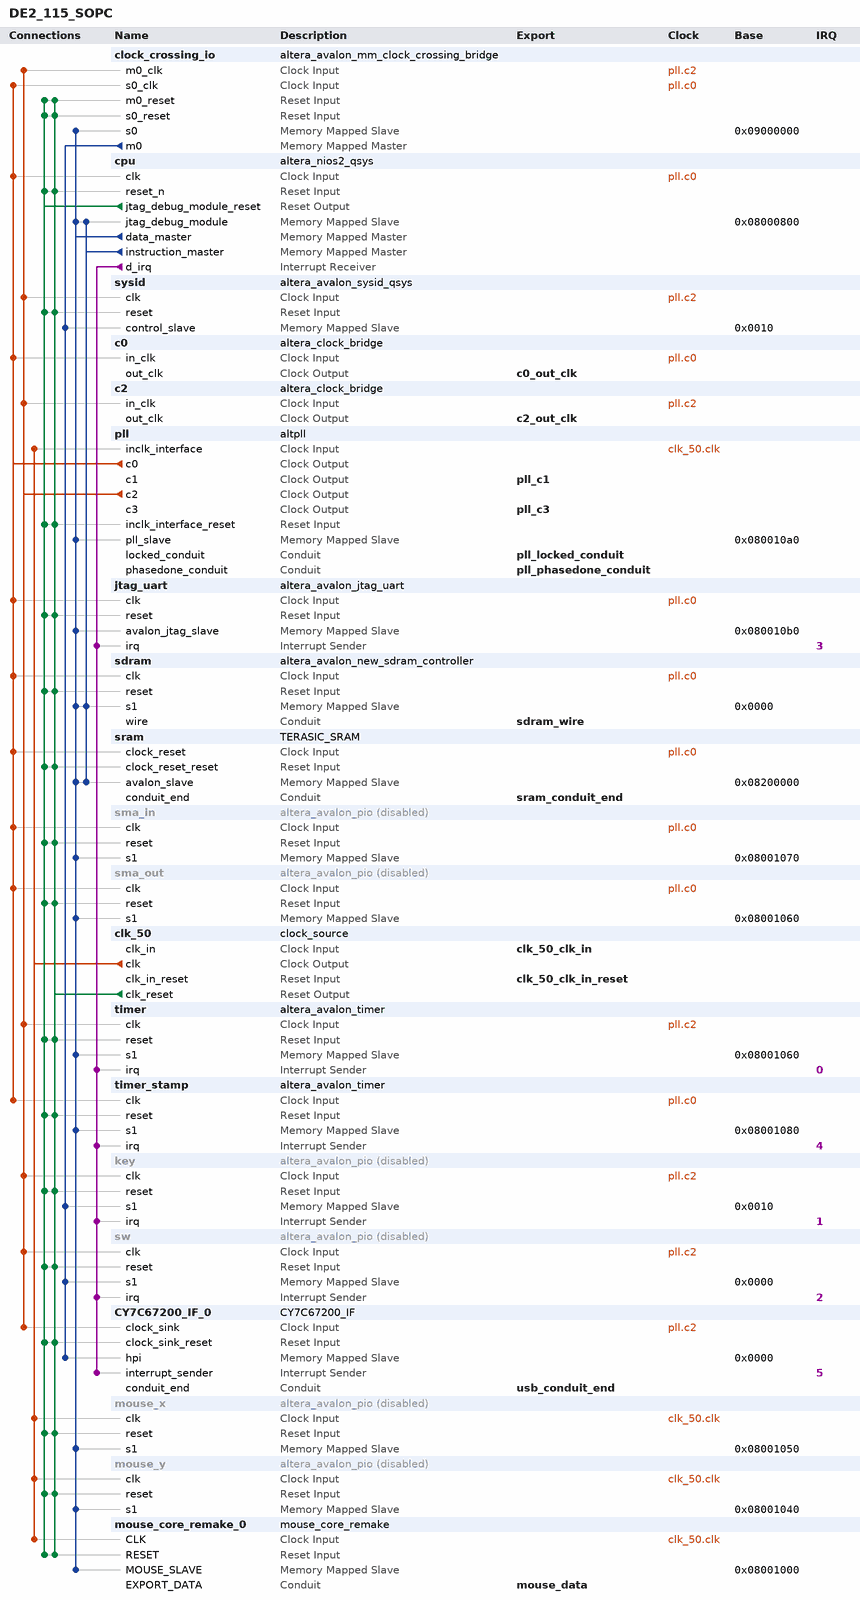
[diagram p0: system contents]
# Platform Designer (Qsys) system DE2_115_SOPC, Cyclone IV E EP4CE115F29C7
# Parameters at their usual value, and those the tool derives, are not listed.
package require -exact qsys 15.0
create_system DE2_115_SOPC
set_project_property DEVICE_FAMILY {Cyclone IV E}
set_project_property DEVICE EP4CE115F29C7

add_instance clock_crossing_io altera_avalon_mm_clock_crossing_bridge 15.0
set_instance_parameter_value clock_crossing_io ADDRESS_WIDTH 22
set_instance_parameter_value clock_crossing_io COMMAND_FIFO_DEPTH 32
set_instance_parameter_value clock_crossing_io DATA_WIDTH 32
set_instance_parameter_value clock_crossing_io MASTER_SYNC_DEPTH 3
set_instance_parameter_value clock_crossing_io MAX_BURST_SIZE 1
set_instance_parameter_value clock_crossing_io RESPONSE_FIFO_DEPTH 256
set_instance_parameter_value clock_crossing_io SLAVE_SYNC_DEPTH 3
set_instance_parameter_value clock_crossing_io USE_AUTO_ADDRESS_WIDTH 0

add_instance cpu altera_nios2_qsys 15.0
set_instance_parameter_value cpu breakSlave cpu.jtag_debug_module
set_instance_parameter_value cpu exceptionSlave sdram.s1
set_instance_parameter_value cpu icache_size 4096
set_instance_parameter_value cpu impl Fast
set_instance_parameter_value cpu manuallyAssignCpuID false
set_instance_parameter_value cpu resetSlave sdram.s1
set_instance_parameter_value cpu resetrequest_enabled true

add_instance sysid altera_avalon_sysid_qsys 15.0
set_instance_parameter_value sysid id 0

add_instance c0 altera_clock_bridge 15.0
set_instance_parameter_value c0 DERIVED_CLOCK_RATE 100000000
set_instance_parameter_value c0 EXPLICIT_CLOCK_RATE 0

add_instance c2 altera_clock_bridge 15.0
set_instance_parameter_value c2 DERIVED_CLOCK_RATE 10000000
set_instance_parameter_value c2 EXPLICIT_CLOCK_RATE 0

add_instance pll altpll 15.0
set_instance_parameter_value pll CLK0_DIVIDE_BY 1
set_instance_parameter_value pll CLK0_MULTIPLY_BY 2
set_instance_parameter_value pll CLK1_DIVIDE_BY 1
set_instance_parameter_value pll CLK1_DUTY_CYCLE 50
set_instance_parameter_value pll CLK1_MULTIPLY_BY 2
set_instance_parameter_value pll CLK1_PHASE_SHIFT -1806
set_instance_parameter_value pll CLK2_DIVIDE_BY 5
set_instance_parameter_value pll CLK2_DUTY_CYCLE 50
set_instance_parameter_value pll CLK2_MULTIPLY_BY 1
set_instance_parameter_value pll CLK2_PHASE_SHIFT 0
set_instance_parameter_value pll CLK3_DIVIDE_BY 2
set_instance_parameter_value pll CLK3_DUTY_CYCLE 50
set_instance_parameter_value pll CLK3_MULTIPLY_BY 1
set_instance_parameter_value pll CLK3_PHASE_SHIFT 0
set_instance_parameter_value pll INCLK0_INPUT_FREQUENCY 20000
set_instance_parameter_value pll PORT_ARESET PORT_USED
set_instance_parameter_value pll PORT_LOCKED PORT_USED
set_instance_parameter_value pll PORT_clk1 PORT_USED
set_instance_parameter_value pll PORT_clk2 PORT_USED
set_instance_parameter_value pll PORT_clk3 PORT_USED

add_instance jtag_uart altera_avalon_jtag_uart 15.0
set_instance_parameter_value jtag_uart simInteractiveOptions INTERACTIVE_ASCII_OUTPUT

add_instance sdram altera_avalon_new_sdram_controller 15.0
set_instance_parameter_value sdram TAC 5.5
set_instance_parameter_value sdram TRCD 20.0
set_instance_parameter_value sdram TRP 20.0
set_instance_parameter_value sdram casLatency 3
set_instance_parameter_value sdram columnWidth 10
set_instance_parameter_value sdram dataWidth 32
set_instance_parameter_value sdram generateSimulationModel true
set_instance_parameter_value sdram model custom
set_instance_parameter_value sdram numberOfBanks 4
set_instance_parameter_value sdram numberOfChipSelects 1
set_instance_parameter_value sdram powerUpDelay 100.0
set_instance_parameter_value sdram refreshPeriod 15.625
set_instance_parameter_value sdram rowWidth 13

add_instance sram TERASIC_SRAM 1.0
set_instance_parameter_value sram ADDR_BITS 20
set_instance_parameter_value sram DATA_BITS 16

add_instance sma_in altera_avalon_pio 15.0
set_instance_property sma_in ENABLED false
set_instance_parameter_value sma_in direction Input
set_instance_parameter_value sma_in width 1

add_instance sma_out altera_avalon_pio 15.0
set_instance_property sma_out ENABLED false
set_instance_parameter_value sma_out direction Output
set_instance_parameter_value sma_out width 1

add_instance clk_50 clock_source 15.0
set_instance_parameter_value clk_50 clockFrequency 50000000

add_instance timer altera_avalon_timer 15.0
set_instance_parameter_value timer period 1
set_instance_parameter_value timer periodUnits MSEC

add_instance timer_stamp altera_avalon_timer 15.0
set_instance_parameter_value timer_stamp period 1
set_instance_parameter_value timer_stamp periodUnits MSEC

add_instance key altera_avalon_pio 15.0
set_instance_property key ENABLED false
set_instance_parameter_value key captureEdge true
set_instance_parameter_value key direction Input
set_instance_parameter_value key edgeType FALLING
set_instance_parameter_value key generateIRQ true
set_instance_parameter_value key irqType EDGE
set_instance_parameter_value key width 4

add_instance sw altera_avalon_pio 15.0
set_instance_property sw ENABLED false
set_instance_parameter_value sw captureEdge true
set_instance_parameter_value sw direction Input
set_instance_parameter_value sw edgeType FALLING
set_instance_parameter_value sw generateIRQ true
set_instance_parameter_value sw irqType EDGE
set_instance_parameter_value sw width 18

add_instance CY7C67200_IF_0 CY7C67200_IF 1.0

add_instance mouse_x altera_avalon_pio 15.0
set_instance_property mouse_x ENABLED false
set_instance_parameter_value mouse_x captureEdge true
set_instance_parameter_value mouse_x direction Output
set_instance_parameter_value mouse_x edgeType FALLING
set_instance_parameter_value mouse_x generateIRQ true
set_instance_parameter_value mouse_x irqType EDGE
set_instance_parameter_value mouse_x width 10

add_instance mouse_y altera_avalon_pio 15.0
set_instance_property mouse_y ENABLED false
set_instance_parameter_value mouse_y captureEdge true
set_instance_parameter_value mouse_y direction Output
set_instance_parameter_value mouse_y edgeType FALLING
set_instance_parameter_value mouse_y generateIRQ true
set_instance_parameter_value mouse_y irqType EDGE
set_instance_parameter_value mouse_y width 10

add_instance mouse_core_remake_0 mouse_core_remake 1.0

# connections
add_connection clk_50.clk mouse_core_remake_0.CLK clock
add_connection clk_50.clk mouse_x.clk clock
add_connection clk_50.clk mouse_y.clk clock
add_connection clk_50.clk pll.inclk_interface clock
add_connection pll.c0 c0.in_clk clock
add_connection pll.c0 clock_crossing_io.s0_clk clock
add_connection pll.c0 cpu.clk clock
add_connection pll.c0 jtag_uart.clk clock
add_connection pll.c0 sdram.clk clock
add_connection pll.c0 sma_in.clk clock
add_connection pll.c0 sma_out.clk clock
add_connection pll.c0 sram.clock_reset clock
add_connection pll.c0 timer_stamp.clk clock
add_connection pll.c2 c2.in_clk clock
add_connection pll.c2 clock_crossing_io.m0_clk clock
add_connection pll.c2 CY7C67200_IF_0.clock_sink clock
add_connection pll.c2 key.clk clock
add_connection pll.c2 sw.clk clock
add_connection pll.c2 sysid.clk clock
add_connection pll.c2 timer.clk clock
add_connection clk_50.clk_reset clock_crossing_io.m0_reset reset
add_connection clk_50.clk_reset clock_crossing_io.s0_reset reset
add_connection clk_50.clk_reset cpu.reset_n reset
add_connection clk_50.clk_reset CY7C67200_IF_0.clock_sink_reset reset
add_connection clk_50.clk_reset jtag_uart.reset reset
add_connection clk_50.clk_reset key.reset reset
add_connection clk_50.clk_reset mouse_core_remake_0.RESET reset
add_connection clk_50.clk_reset mouse_x.reset reset
add_connection clk_50.clk_reset mouse_y.reset reset
add_connection clk_50.clk_reset pll.inclk_interface_reset reset
add_connection clk_50.clk_reset sdram.reset reset
add_connection clk_50.clk_reset sma_in.reset reset
add_connection clk_50.clk_reset sma_out.reset reset
add_connection clk_50.clk_reset sram.clock_reset_reset reset
add_connection clk_50.clk_reset sw.reset reset
add_connection clk_50.clk_reset sysid.reset reset
add_connection clk_50.clk_reset timer.reset reset
add_connection clk_50.clk_reset timer_stamp.reset reset
add_connection cpu.jtag_debug_module_reset clock_crossing_io.m0_reset reset
add_connection cpu.jtag_debug_module_reset clock_crossing_io.s0_reset reset
add_connection cpu.jtag_debug_module_reset cpu.reset_n reset
add_connection cpu.jtag_debug_module_reset CY7C67200_IF_0.clock_sink_reset reset
add_connection cpu.jtag_debug_module_reset jtag_uart.reset reset
add_connection cpu.jtag_debug_module_reset key.reset reset
add_connection cpu.jtag_debug_module_reset mouse_core_remake_0.RESET reset
add_connection cpu.jtag_debug_module_reset mouse_x.reset reset
add_connection cpu.jtag_debug_module_reset mouse_y.reset reset
add_connection cpu.jtag_debug_module_reset pll.inclk_interface_reset reset
add_connection cpu.jtag_debug_module_reset sdram.reset reset
add_connection cpu.jtag_debug_module_reset sma_in.reset reset
add_connection cpu.jtag_debug_module_reset sma_out.reset reset
add_connection cpu.jtag_debug_module_reset sram.clock_reset_reset reset
add_connection cpu.jtag_debug_module_reset sw.reset reset
add_connection cpu.jtag_debug_module_reset sysid.reset reset
add_connection cpu.jtag_debug_module_reset timer.reset reset
add_connection cpu.jtag_debug_module_reset timer_stamp.reset reset
add_connection clock_crossing_io.m0 CY7C67200_IF_0.hpi avalon
set_connection_parameter_value clock_crossing_io.m0/CY7C67200_IF_0.hpi baseAddress 0x0000
add_connection clock_crossing_io.m0 key.s1 avalon
set_connection_parameter_value clock_crossing_io.m0/key.s1 baseAddress 0x0010
add_connection clock_crossing_io.m0 sw.s1 avalon
set_connection_parameter_value clock_crossing_io.m0/sw.s1 baseAddress 0x0000
add_connection clock_crossing_io.m0 sysid.control_slave avalon
set_connection_parameter_value clock_crossing_io.m0/sysid.control_slave baseAddress 0x0010
add_connection cpu.data_master clock_crossing_io.s0 avalon
set_connection_parameter_value cpu.data_master/clock_crossing_io.s0 baseAddress 0x09000000
add_connection cpu.data_master cpu.jtag_debug_module avalon
set_connection_parameter_value cpu.data_master/cpu.jtag_debug_module baseAddress 0x08000800
add_connection cpu.data_master jtag_uart.avalon_jtag_slave avalon
set_connection_parameter_value cpu.data_master/jtag_uart.avalon_jtag_slave baseAddress 0x080010b0
add_connection cpu.data_master mouse_core_remake_0.MOUSE_SLAVE avalon
set_connection_parameter_value cpu.data_master/mouse_core_remake_0.MOUSE_SLAVE baseAddress 0x08001000
add_connection cpu.data_master mouse_x.s1 avalon
set_connection_parameter_value cpu.data_master/mouse_x.s1 baseAddress 0x08001050
add_connection cpu.data_master mouse_y.s1 avalon
set_connection_parameter_value cpu.data_master/mouse_y.s1 baseAddress 0x08001040
add_connection cpu.data_master pll.pll_slave avalon
set_connection_parameter_value cpu.data_master/pll.pll_slave baseAddress 0x080010a0
add_connection cpu.data_master sdram.s1 avalon
set_connection_parameter_value cpu.data_master/sdram.s1 baseAddress 0x0000
add_connection cpu.data_master sma_in.s1 avalon
set_connection_parameter_value cpu.data_master/sma_in.s1 baseAddress 0x08001070
add_connection cpu.data_master sma_out.s1 avalon
set_connection_parameter_value cpu.data_master/sma_out.s1 baseAddress 0x08001060
add_connection cpu.data_master sram.avalon_slave avalon
set_connection_parameter_value cpu.data_master/sram.avalon_slave baseAddress 0x08200000
add_connection cpu.data_master timer.s1 avalon
set_connection_parameter_value cpu.data_master/timer.s1 baseAddress 0x08001060
add_connection cpu.data_master timer_stamp.s1 avalon
set_connection_parameter_value cpu.data_master/timer_stamp.s1 baseAddress 0x08001080
add_connection cpu.instruction_master cpu.jtag_debug_module avalon
set_connection_parameter_value cpu.instruction_master/cpu.jtag_debug_module baseAddress 0x08000800
add_connection cpu.instruction_master sdram.s1 avalon
set_connection_parameter_value cpu.instruction_master/sdram.s1 baseAddress 0x0000
add_connection cpu.instruction_master sram.avalon_slave avalon
set_connection_parameter_value cpu.instruction_master/sram.avalon_slave baseAddress 0x08200000
add_connection cpu.d_irq CY7C67200_IF_0.interrupt_sender interrupt
set_connection_parameter_value cpu.d_irq/CY7C67200_IF_0.interrupt_sender irqNumber 5
add_connection cpu.d_irq jtag_uart.irq interrupt
set_connection_parameter_value cpu.d_irq/jtag_uart.irq irqNumber 3
add_connection cpu.d_irq key.irq interrupt
set_connection_parameter_value cpu.d_irq/key.irq irqNumber 1
add_connection cpu.d_irq sw.irq interrupt
set_connection_parameter_value cpu.d_irq/sw.irq irqNumber 2
add_connection cpu.d_irq timer.irq interrupt
set_connection_parameter_value cpu.d_irq/timer.irq irqNumber 0
add_connection cpu.d_irq timer_stamp.irq interrupt
set_connection_parameter_value cpu.d_irq/timer_stamp.irq irqNumber 4

# exported interfaces
add_interface c0_out_clk clock source
set_interface_property c0_out_clk EXPORT_OF c0.out_clk
add_interface c2_out_clk clock source
set_interface_property c2_out_clk EXPORT_OF c2.out_clk
add_interface clk_50_clk_in clock sink
set_interface_property clk_50_clk_in EXPORT_OF clk_50.clk_in
add_interface clk_50_clk_in_reset reset sink
set_interface_property clk_50_clk_in_reset EXPORT_OF clk_50.clk_in_reset
add_interface mouse_data conduit end
set_interface_property mouse_data EXPORT_OF mouse_core_remake_0.EXPORT_DATA
add_interface pll_c1 clock source
set_interface_property pll_c1 EXPORT_OF pll.c1
add_interface pll_c3 clock source
set_interface_property pll_c3 EXPORT_OF pll.c3
add_interface pll_locked_conduit conduit end
set_interface_property pll_locked_conduit EXPORT_OF pll.locked_conduit
add_interface pll_phasedone_conduit conduit end
set_interface_property pll_phasedone_conduit EXPORT_OF pll.phasedone_conduit
add_interface sdram_wire conduit end
set_interface_property sdram_wire EXPORT_OF sdram.wire
add_interface sram_conduit_end conduit end
set_interface_property sram_conduit_end EXPORT_OF sram.conduit_end
add_interface usb_conduit_end conduit end
set_interface_property usb_conduit_end EXPORT_OF CY7C67200_IF_0.conduit_end

set_interconnect_requirement {$system} qsys_mm.clockCrossingAdapter HANDSHAKE
set_interconnect_requirement {$system} qsys_mm.maxAdditionalLatency 0

save_system DE2_115_SOPC.qsys
